# EasyEDA Pro project ProProject_雾化加湿器_2023-11-25.epro

# Schematic Schematic1
Create Date: 2023-11-10; Page Name: P1; Project Name: 雾化加湿器; Schematic Name: Schematic1; Update Date: 2023-12-05; Company: 嘉立创EDA; Page Size: A3; Version: V1.0
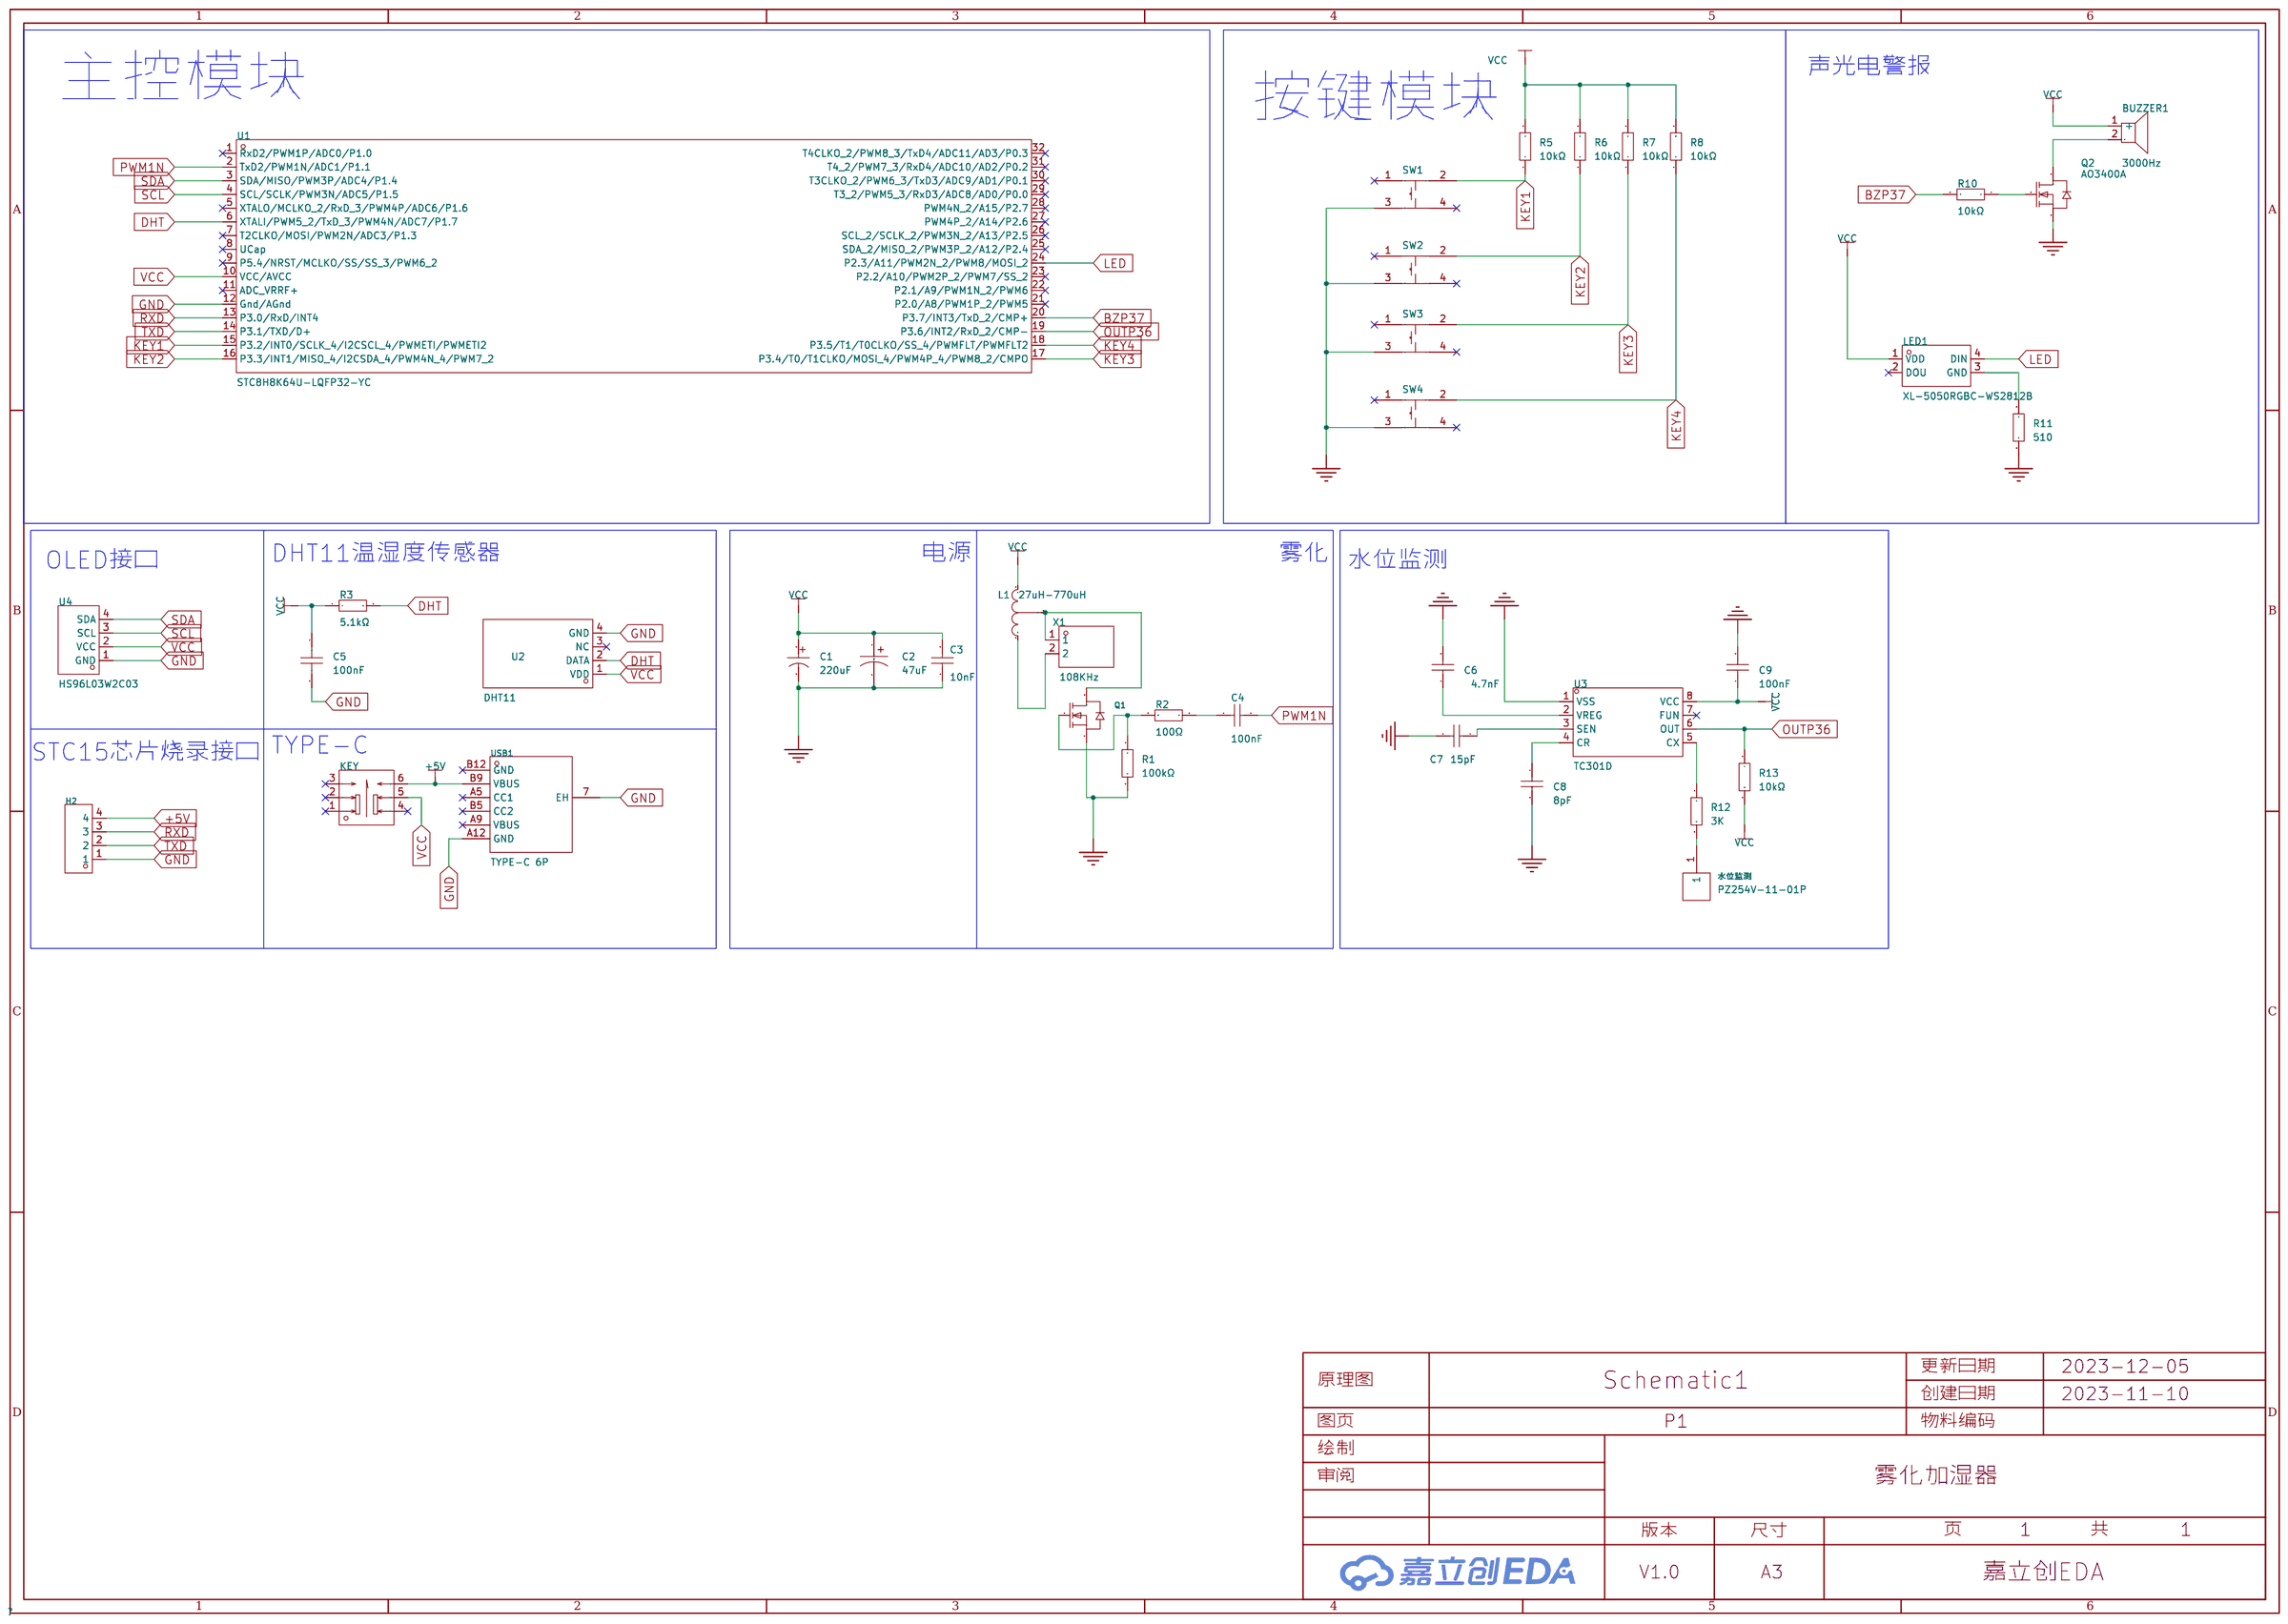
[diagram p0: schematic sheet]

## Parts
BUZZER1  3000Hz  [BUZ-TH_BD9.6-P5.00-D0.7-FD]
C1  220uF  [CAP-TH_BD10.0-P5.00-D1.0-FD]
C2  47uF  [CAP-TH_BD5.0-P2.00-D0.8-FD]
C3  10nF  [C0805]
C4  100nF  [C0805]
C5  100nF  [C0805]
C6  4.7nF  [C0805]
C7  15pF  [C0805]
C8  8pF  [C0805]
C9  100nF  [C0805]
H2  PZ254R-11-04P  [HDR-TH_4P-P2.54-V-M]
KEY  XKB5858-Z  [SW-TH_6P-L5.8-W5.8-P2.00-LS4.5-BL]
L1  27uH-770uH  [三脚电感]
LED1  XL-5050RGBC-WS2812B  [LED-SMD_4P-L5.0-W5.0-BL_XL-5050RGBC]
Q1  AO3400-HXY  [SOT-23_L2.9-W1.3-P1.90-LS2.4-BR]
Q2  AO3400A  [SOT-23_L2.9-W1.3-P1.90-LS2.4-BR]
R1  100kΩ  [R0805]
R2  100Ω  [R0805]
R3  5.1kΩ  [R0805]
R5  10kΩ  [R0805]
R6  10kΩ  [R0805]
R7  10kΩ  [R0805]
R8  10kΩ  [R0805]
R10  10kΩ  [R0805]
R11  510  [R0805]
R12  3K  [R0805]
R13  10kΩ  [R0805]
SW1  TS-1009S-03826  [SW-SMD_4P-L4.5-W4.5-P3.00-LS7.0]
SW2  TS-1009S-03826  [SW-SMD_4P-L4.5-W4.5-P3.00-LS7.0]
SW3  TS-1009S-03826  [SW-SMD_4P-L4.5-W4.5-P3.00-LS7.0]
SW4  TS-1009S-03826  [SW-SMD_4P-L4.5-W4.5-P3.00-LS7.0]
U1  STC8H8K64U-LQFP32-YC  [LQFP-32_L7.0-W7.0-P0.80-LS9.0-BL]
U2  DHT11  [SENSOR-TH_DHT11]
U3  TC301D  [SO-8_L4.9-W3.9-P1.27-LS5.9-BL]
U4  HS96L03W2C03  [OLED-TH_L27.8-W27.2-P2.54_C9900033791]
USB1  TYPE-C 6P  [TYPE-C-SMD_TYPE-C-6P]
X1  108KHz  [CONN-TH_B2B-XH-A-LF-SN]
水位监测  PZ254V-11-01P  [HDR-TH_1P-P2.54-V-M]

## Library data of the parts
BUZZER1 = HNB09A05: 驱动方式:有源(内含驱动线路);构造类型:电磁式;额定电压:5V;工作电压:4V~8V;频率:3000Hz;声压(SPL):85dB@5V,10cm;直径(φD):9mm;高度:5.7mm;; Supplier Part: C96493; Manufacturer: 华能; Supplier Footprint: 插件; JLCPCB Part Class: 扩展库; Datasheet: https://atta.szlcsc.com/upload/public/pdf/source/20170522/1495448327549.pdf; Supplier: LCSC; Oscillator Circuit: 有源(内含驱动线路); Technology Type: 电磁式; Rated Voltage: 5V; Operating Voltage: 4V~8V; Sound Pressure Level (SPL): 85dB@5V,10cm; Diameter (φD): 9mm; Height: 5.7mm
C1 = RNG221M1EBK-1012: 容值:220uF;精度:±20%;额定电压:25V;纹波电流:-;等效串联电阻:-;; LCSC Part Name: 220uF ±20% 25V 无极性电解电容; Supplier Part: C311677; Manufacturer: lelon(立隆); Supplier Footprint: 插件,D10xL12.5mm; JLCPCB Part Class: 扩展库; Datasheet: https://atta.szlcsc.com/upload/public/pdf/source/20180930/C311677_B35ED41A8A09BD51C9FDED5E2B65C0E1.pdf; Supplier: LCSC; Tolerance: ±20%; Rated Voltage: 25V; φD: 10mm; L: 12.5mm; Lead Spacing: 5mm; Lifetime @ Temp: 2000hrs@105℃
C2 = 01EC1882SHG47uF16V: 容值:47uF;精度:±20%;额定电压:16V;纹波电流:95mA@100kHz;等效串联电阻:2.5Ω@100kHz;; LCSC Part Name: 47uF ±20% 16V 高频低阻抗电解电容器; Supplier Part: C503214; Manufacturer: KNSCHA(科尼盛); Supplier Footprint: 插件,D5xL11mm; JLCPCB Part Class: 扩展库; Datasheet: https://atta.szlcsc.com/upload/public/pdf/source/20200324/C503214_31C96C8D88F229C9201DC621C0C9C05E.pdf; Supplier: LCSC; Tolerance: ±20%; Rated Voltage: 16V; φD: 5mm; L: 11mm; Lead Spacing: 2mm; Ripple Current: 95mA@100kHz; Equivalent Series Resistance(ESR): 2.5Ω@100kHz; Lifetime @ Temp: 10000hrs@105℃
C3 C4 C6-C9 = 0805B103K500NT_C52278: 容值:10nF;精度:±10%;额定电压:50V;材质(温度系数):X7R;; LCSC Part Name: 10nF ±10% 50V; Supplier Part: C52278; Manufacturer: FH(风华); Manufacturer Part: 0805B103K500NT; Supplier Footprint: 0805; JLCPCB Part Class: 扩展库; Datasheet: https://atta.szlcsc.com/upload/public/pdf/source/20170923/C52278_1506149485247988826.pdf; Supplier: LCSC; Tolerance: ±10%; Voltage Rated: 50V; Temperature Coefficient: X7R
C5 = CT41G-0805-2X1-50V-0.1μF-K(N): 容值:100nF;精度:±10%;额定电压:50V;材质(温度系数):2X1;; LCSC Part Name: 100nF ±10% 50V; Supplier Part: C126469; Manufacturer: TORCH(火炬); Supplier Footprint: 0805; JLCPCB Part Class: 扩展库; Datasheet: https://atta.szlcsc.com/upload/public/pdf/source/20171225/C150708_15141883600121203188.pdf; Supplier: LCSC; Tolerance: ±10%; Voltage Rated: 50V; Temperature Coefficient: 2X1
H2 = PZ254R-11-04P: 间距:2.54mm;总PIN位数:4;排数:1;插针结构:1x4P;行距:-;安装类型:弯插;圆针/方针:方针;额定电流:-;额定电压:-;配合针长度:6mm;塑高:2.5mm;触头材质:黄铜;触头镀层:-;工作温度范围:-40℃~+105℃;颜色:黑色;; LCSC Part Name: 2.54mm 1x4P 弯插 方针; Supplier Part: C492412; Manufacturer: XFCN(兴飞); Supplier Footprint: 插件,P=2.54mm; JLCPCB Part Class: 扩展库; Supplier: LCSC; Pitch: 2.54mm; Number of Pins: 4; Number of Rows: 1; Pin Structure: 1x4P; Mounting Type: 弯插; Circluar Pins/Square Pins: 方针; Length of Mating Pin: 6mm; Insulation Height: 2.5mm; Contact Material: 黄铜; Operating Temperature Range: -40℃~+105℃; Color: 黑色
KEY = XKB5858-Z: 触点电流:100mA;额定电压 (AC):250V;额定电压 (DC):30V;绝缘电阻:100MΩ;电路结构:-;安装方式:直插;自锁/无锁:自锁;按键形状:矩形按钮;按键/盖帽颜色:白色;带灯:无;引脚样式:PC引脚;作用力:160gf@±80gf;防护等级:-;工作温度:-15℃~+55℃;机械寿命:10000;; LCSC Part Name: 按键开关   5.8*5.8插件自锁开关; Supplier Part: C318868; Manufacturer: XKB Connectivity(中国星坤); Supplier Footprint: 插件; JLCPCB Part Class: 扩展库; Datasheet: https://atta.szlcsc.com/upload/public/pdf/source/20181029/C318868_9BE55E0EBE6A2C886ABBB20B390835AF.pdf; Supplier: LCSC; Contact Current: 100mA; Voltage Rating (AC): 250V; Voltage Rating (DC): 30V; Insulation Resistance: 100MΩ; Mounting Style: 直插; Self Lock / No Lock: 自锁; Actuator Style: 矩形按钮; Actuator/Cap Color: 白色; With Lamp: 无; Pin Style: PC引脚; Operating Force: 160gf@±80gf; Operating Temperature: -15℃~+55℃; Mechanical Life: 10000
L1 = PDPTAT0810-2R2M: 电感值:2.2uH;精度:±20%;额定电流:7A;饱和电流(Isat):11A;; LCSC Part Name: 2.2uH ±20% 11A; Supplier Part: C5119615; Manufacturer: PROD(谱罗德); Supplier Footprint: 插件,D9.5xL12mm; JLCPCB Part Class: 扩展库; Datasheet: https://atta.szlcsc.com/upload/public/pdf/source/20220822/5B60B05AFB4608D4108D4169B534A2A0.pdf; Supplier: LCSC; Tolerance: ±20%; Rated Current: 7A; Current - Saturation (Isat): 11A; DC Resistance: 11mΩ
LED1 = XL-5050RGBC-WS2812B: 发光颜色:RGB三色;二极管配置:-;主波长:-;色温:-;功率:-;安装方式:正贴;; LCSC Part Name: RGB三色 正贴 幻彩; Supplier Part: C2843785; Manufacturer: XINGLIGHT(成兴光); Supplier Footprint: SMD5050; JLCPCB Part Class: 扩展库; Datasheet: https://atta.szlcsc.com/upload/public/pdf/source/20230111/86AAD2096485A2E5BCAB883FF8CBE6FD.pdf; Supplier: LCSC; Emitted Color: RGB三色; Lens Color: 无色透明; Peak Wavelength: 625nm；470nm；530nm; Viewing Angle: 120°; Mounting Sytle: 正贴; Operating Temperature: -30℃~+70℃
Q1 = AO3400-HXY: 类型:N沟道;漏源电压(Vdss):30V;连续漏极电流(Id):5.8A;功率(Pd):1.4W;导通电阻(RDS(on)@Vgs,Id):28mΩ@10V,5.8A;; LCSC Part Name: N沟道 30V 5.8A; Supplier Part: C4748804; Manufacturer: HXY MOSFET(华轩阳电子); Supplier Footprint: SOT-23; JLCPCB Part Class: 扩展库; Datasheet: https://atta.szlcsc.com/upload/public/pdf/source/20221216/C6CAAE960F4F5F0616BD2E5413E1C3AD.pdf; Supplier: LCSC; Type: N沟道; Drain Source Voltage (Vdss): 30V; Continuous Drain Current (Id): 5.8A; Power Dissipation (Pd): 1.4W; Drain Source On Resistance (RDS(on)@Vgs,Id): 28mΩ@10V,5.8A; Gate Threshold Voltage (Vgs(th)@Id): 1.4V@250uA; Input Capacitance (Ciss@Vds): 825pF@15V
Q2 = AO3400A_C344010: 类型:N沟道;漏源电压(Vdss):30V;连续漏极电流(Id):5.8A;功率(Pd):1.4W;导通电阻(RDS(on)@Vgs,Id):32mΩ@10V,5.8A;阈值电压(Vgs(th)@Id):1.4V@250uA;; LCSC Part Name: N沟道 30V 5.8A; Supplier Part: C344010; Manufacturer: BORN(伯恩半导体); Supplier Footprint: SOT-23; JLCPCB Part Class: 扩展库; Datasheet: https://atta.szlcsc.com/upload/public/pdf/source/20181211/C344010_1A88330921524F88534EF594457919E8.pdf; Supplier: LCSC; Type: N沟道; Drain Source Voltage (Vdss): 30V; Continuous Drain Current (Id): 5.8A; Power Dissipation (Pd): 1.4W; Drain Source On Resistance (RDS(on)@Vgs,Id): 32mΩ@10V,5.8A; Gate Threshold Voltage (Vgs(th)@Id): 1.4V@250uA
R1 R2 R5-R8 R10-R13 = 0805W8F1002T5E_C17414: 电阻类型:厚膜电阻;阻值:10kΩ;精度:±1%;功率:125mW;; LCSC Part Name: 10kΩ ±1% 125mW; Supplier Part: C17414; Manufacturer: UNI-ROYAL(厚声); Manufacturer Part: 0805W8F1002T5E; Supplier Footprint: 0805; JLCPCB Part Class: 基础库; Datasheet: https://atta.szlcsc.com/upload/public/pdf/source/20200306/C422600_1E6D84923E4A46A82E41ADD87F860B5C.pdf; Supplier: LCSC; Type: 厚膜电阻; Tolerance: ±1%; Power(Watts): 125mW; Temperature Coefficient: ±100ppm/℃; Overload Voltage (Max): 150V; Operating Temperature Range: -55℃~+155℃
R3 = 0805W8F5101T5E: 电阻类型:厚膜电阻;阻值:5.1kΩ;精度:±1%;功率:125mW;; LCSC Part Name: 5.1kΩ ±1% 125mW; Supplier Part: C27834; Manufacturer: UNI-ROYAL(厚声); Supplier Footprint: 0805; JLCPCB Part Class: 基础库; Datasheet: https://atta.szlcsc.com/upload/public/pdf/source/20200306/C422600_1E6D84923E4A46A82E41ADD87F860B5C.pdf; Supplier: LCSC; Type: 厚膜电阻; Tolerance: ±1%; Power(Watts): 125mW; Temperature Coefficient: ±100ppm/℃; Overload Voltage (Max): 150V; Operating Temperature Range: -55℃~+155℃
SW1-SW4 = TS-1009S-03826: 触点电流:50mA;额定电压(DC):12V;电路结构:单刀单掷;安装方式:立贴;带灯:-;机械寿命:-;; LCSC Part Name: 4.5*4.5*3.8mm 立贴 轻触开关; Supplier Part: C455243; Manufacturer: XUNPU(讯普); Supplier Footprint: SMD,4.5x4.5mm; JLCPCB Part Class: 扩展库; Datasheet: https://atta.szlcsc.com/upload/public/pdf/source/20191118/C455243_A418D3F018154E2D7AB449710B6F1A73.pdf; Supplier: LCSC; Contact Current: 50mA; Voltage Rating (DC): 12V; Circuit: 单刀单掷; Mounting Style: 立贴; Actuator Style: 圆形按钮; Switch Length: 4.5mm; Switch Width: 4.5mm; Switch Height: 3.8mm
U1 = STC8H8K64U-LQFP32-YC: Supplier Part: C9900031452; Supplier Footprint: LQFP-32_L7.0-W7.0-P0.80-LS9.0-; JLCPCB Part Class: 扩展库; Supplier: LCSC
U2 = DHT11: 新款电容式数字温湿度传感器,老款已停产16.1x12.6x5.8mm; LCSC Part Name: DHT11  电容式传感器; Supplier Part: C117051; Manufacturer: 广州奥松; Supplier Footprint: SIP-4; JLCPCB Part Class: 扩展库; Datasheet: https://atta.szlcsc.com/upload/public/pdf/source/20170703/1499081238365.pdf; Supplier: LCSC
U3 = TC301D: LCSC Part Name: 单通道水位检测/人体感应; Supplier Part: C362144; Manufacturer: NUTECH(诺泰); Supplier Footprint: SO-8; JLCPCB Part Class: 扩展库; Datasheet: https://atta.szlcsc.com/upload/public/pdf/source/20191125/C362144_027B89DBA359C9125D5EE7B15DEF22AA.pdf; Supplier: LCSC
U4 = HS96L03W2C03: 尺寸(inch)：0.96寸 0.96&apos; 像素分辨率：128x64 128*64主控芯片：SSD1315 接口类型：I2C 外形:27.3*27.8；IIC/3SPI/4SPI串口通讯,工作温度范围-40℃—+70℃。4PIN黑底白光。; LCSC Part Name: 0.96寸OLED显示屏窄白光IIC; Supplier Part: C5248080; Manufacturer: HS(汉昇); JLCPCB Part Class: 扩展库; Datasheet: https://atta.szlcsc.com/upload/public/pdf/source/20230627/763D01F79A90007632F098068C7C8AD9.pdf; Supplier: LCSC
USB1 = TYPE-C 6P: 连接器类型:Type-C;标准:-;公母:母座;触点数量:6;端口数量:1;安装方式:卧贴;额定电流 - 电源:-;工作温度范围:-40℃~+85℃;; LCSC Part Name: Type-C 母头 6pin简易款四脚端子SMT+DIP 停产; Supplier Part: C456012; Manufacturer: SHOU HAN(首韩); Supplier Footprint: SMD; JLCPCB Part Class: 扩展库; Supplier: LCSC; Connector Type: Type-C; Gender: 母座; Number of Contacts: 6; Number of Ports: 1; Mounting Style: 卧贴; Operating Temperature Range: -40℃~+85℃
X1 = B2B-XH-A(LF)(SN): 参考系列:XH;间距:2.5mm;插针结构:1x2P;排数:1;每排PIN数:2;行距:-;安装方式:-;触头材质:黄铜;; LCSC Part Name: 系列:XH 间距:2.5mm 1x2P; Supplier Part: C158012; Manufacturer: JST; Supplier Footprint: 插件,P=2.5mm; JLCPCB Part Class: 扩展库; Datasheet: https://atta.szlcsc.com/upload/public/pdf/source/20180928/C265283_F9DFEEBDB2CF642B6BDFAB4B77BD2680.pdf; Supplier: LCSC; Reference Series: XH; Pitch: 2.5mm; Pins Structure: 1x2P; Number of Rows: 1; Number of PINs Per Row: 2; Contact Material: 黄铜
水位监测 = PZ254V-11-01P: 排数:单排;总PIN位数:1P;间距:2.54mm;插针结构:1x1P;行距:-;安装类型:直插;圆针/方针:方针;额定电流:-;额定电压:-;配合针长度:6mm;塑高:2.5mm;端接针长度:3mm;触头材质:黄铜;触头镀层:-;工作温度范围:-40℃~+105℃;颜色:黑色;; LCSC Part Name: 2.54mm 1x1P 直插 方针; Supplier Part: C492400; Manufacturer: XFCN(兴飞); Supplier Footprint: 插件,P=2.54mm; JLCPCB Part Class: Extended Part; Datasheet: https://atta.szlcsc.com/upload/public/pdf/source/20200309/C492400_46876A5B545F5AE6B8D4A09C46E276E8.pdf; Supplier: LCSC; Number of Rows: 单排; Number of Pins: 1P; Pitch: 2.54mm; Pin Structure: 1x1P; Mounting Type: 直插; Circluar Pins/Square Pins: 方针; Length of Mating Pin: 6mm; Insulation Height: 2.5mm; Length of End Connection Pin: 3mm; Contact Material: 黄铜; Operating Temperature Range: -40℃~+105℃; Color: 黑色

## Nets
+5V: H2.4 KEY.6 USB1.B9(VBUS)
GND: C1.2 C2.2 C3.1 C5.2 C6.2 C7.2 C8.2 C9.2 H2.1 Q1.2(S) Q2.2(S) R1.2 R11.1 SW1.3 SW2.3 SW3.3 SW4.3 U1.12(Gnd/AGnd) U2.4(GND) U3.1(VSS) U4.1(GND) USB1.7(EH) USB1.A12(GND)
VCC: BUZZER1.1(+) C1.1 C2.1 C3.2 C5.1 C9.1 KEY.5 L1.1 LED1.1(VDD) R3.1 R5.2 R6.2 R7.2 R8.2 R13.2 U1.10(VCC/AVCC) U2.1(VDD) U3.8(VCC) U4.2(VCC)
BZP37: R10.2 U1.20(P3.7/INT3/TxD_2/CMP+)
DHT: R3.2 U1.6(XTALI/PWM5_2/TxD_3/PWM4N/ADC7/P1.7) U2.2(DATA)
KEY1: R5.1 SW1.2 U1.15(P3.2/INT0/SCLK_4/I2CSCL_4/PWMETI/PWMETI2)
KEY2: R6.1 SW2.2 U1.16(P3.3/INT1/MISO_4/I2CSDA_4/PWM4N_4/PWM7_2)
KEY3: R7.1 SW3.2 U1.17(P3.4/T0/T1CLKO/MOSI_4/PWM4P_4/PWM8_2/CMPO)
KEY4: R8.1 SW4.2 U1.18(P3.5/T1/T0CLKO/SS_4/PWMFLT/PWMFLT2)
LED: LED1.4(DIN) U1.24(P2.3/A11/PWM2N_2/PWM8/MOSI_2)
OUTP36: R13.1 U1.19(P3.6/INT2/RxD_2/CMP-) U3.6(OUT)
PWM1N: C4.2 U1.2(TxD2/PWM1N/ADC1/P1.1)
RXD: H2.3 U1.13(P3.0/RxD/INT4)
SCL: U1.4(SCL/SCLK/PWM3N/ADC5/P1.5) U4.3(SCL)
SDA: U1.3(SDA/MISO/PWM3P/ADC4/P1.4) U4.4(SDA)
TXD: H2.2 U1.14(P3.1/TXD/D+)
$1N10142: L1.2 X1.2
$1N10159: L1.3 Q1.3(D) X1.1
$1N10823: C4.1 R2.1
$1N13950: C6.1 U3.2(VREG)
$1N13954: C7.1 U3.3(SEN)
$1N13974: C8.1 U3.4(CR)
$1N14222: R12.1 U3.5(CX)
$1N14357: R12.2 水位监测.1
$1N14582: Q2.1(G) R10.1
$1N14588: BUZZER1.2 Q2.3(D)
$1N14898: LED1.3(GND) R11.2
$1N21387: Q1.1(G) R1.1 R2.2

Not connected (* = marked no-connect by the designer): KEY 1* 2* 3* 4*; LED1 2(DOU)*; SW1 1* 4*; SW2 1* 4*; SW3 1* 4*; SW4 1* 4*; U1 1(RxD2/PWM1P/ADC0/P1.0)* 5(XTALO/MCLKO_2/RxD_3/PWM4P/ADC6/P1.6)* 7(T2CLKO/MOSI/PWM2N/ADC3/P1.3)* 8(UCap)* 9(P5.4/NRST/MCLKO/SS/SS_3/PWM6_2)* 11(ADC_VRRF+)* 21(P2.0/A8/PWM1P_2/PWM5)* 22(P2.1/A9/PWM1N_2/PWM6)* 23(P2.2/A10/PWM2P_2/PWM7/SS_2)* 25(SDA_2/MISO_2/PWM3P_2/A12/P2.4)* 26(SCL_2/SCLK_2/PWM3N_2/A13/P2.5)* 27(PWM4P_2/A14/P2.6)* 28(PWM4N_2/A15/P2.7)* 29(T3_2/PWM5_3/RxD3/ADC8/AD0/P0.0)* 30(T3CLKO_2/PWM6_3/TxD3/ADC9/AD1/P0.1)* 31(T4_2/PWM7_3/RxD4/ADC10/AD2/P0.2)* 32(T4CLKO_2/PWM8_3/TxD4/ADC11/AD3/P0.3)*; U2 3(NC)*; U3 7(FUN)*; USB1 A5(CC1)* A9(VBUS)* B5(CC2)* B12(GND)*

## Notes on the sheet
- 声光电警报
- 主控模块
- 按键模块
- DHT11温湿度传感器
- 电源
- 雾化
- OLED接口
- 水位监测
- TYPE-C
- STC15芯片烧录接口

# Board PCB1
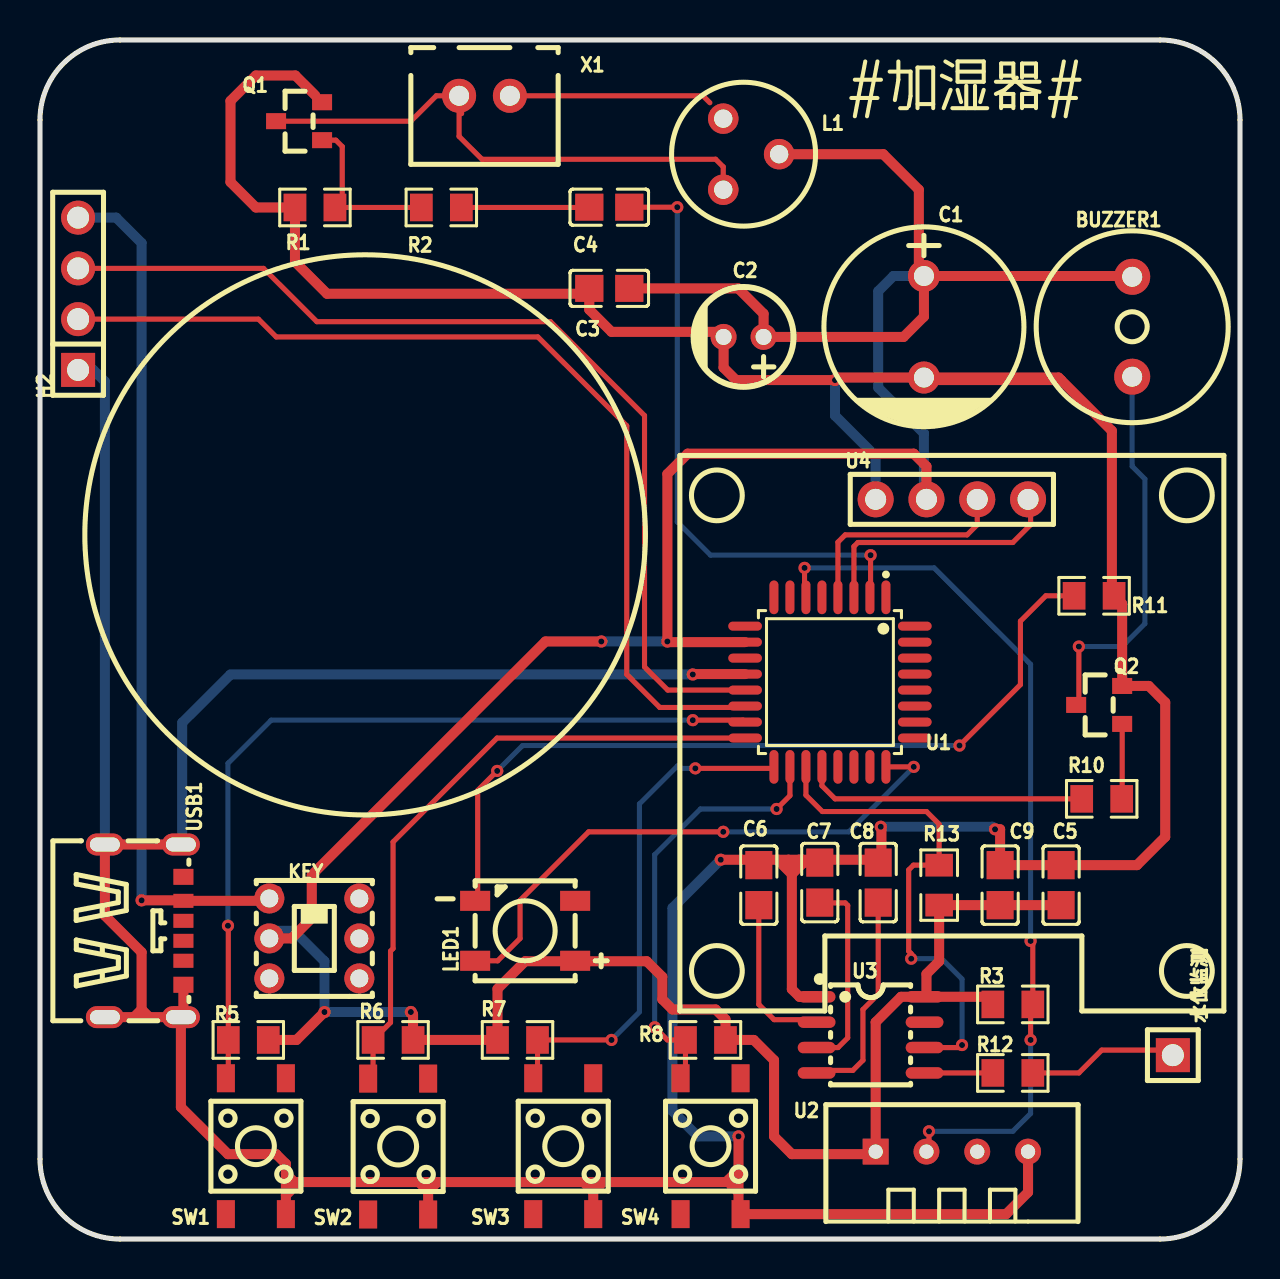
[diagram p1: board, top side]
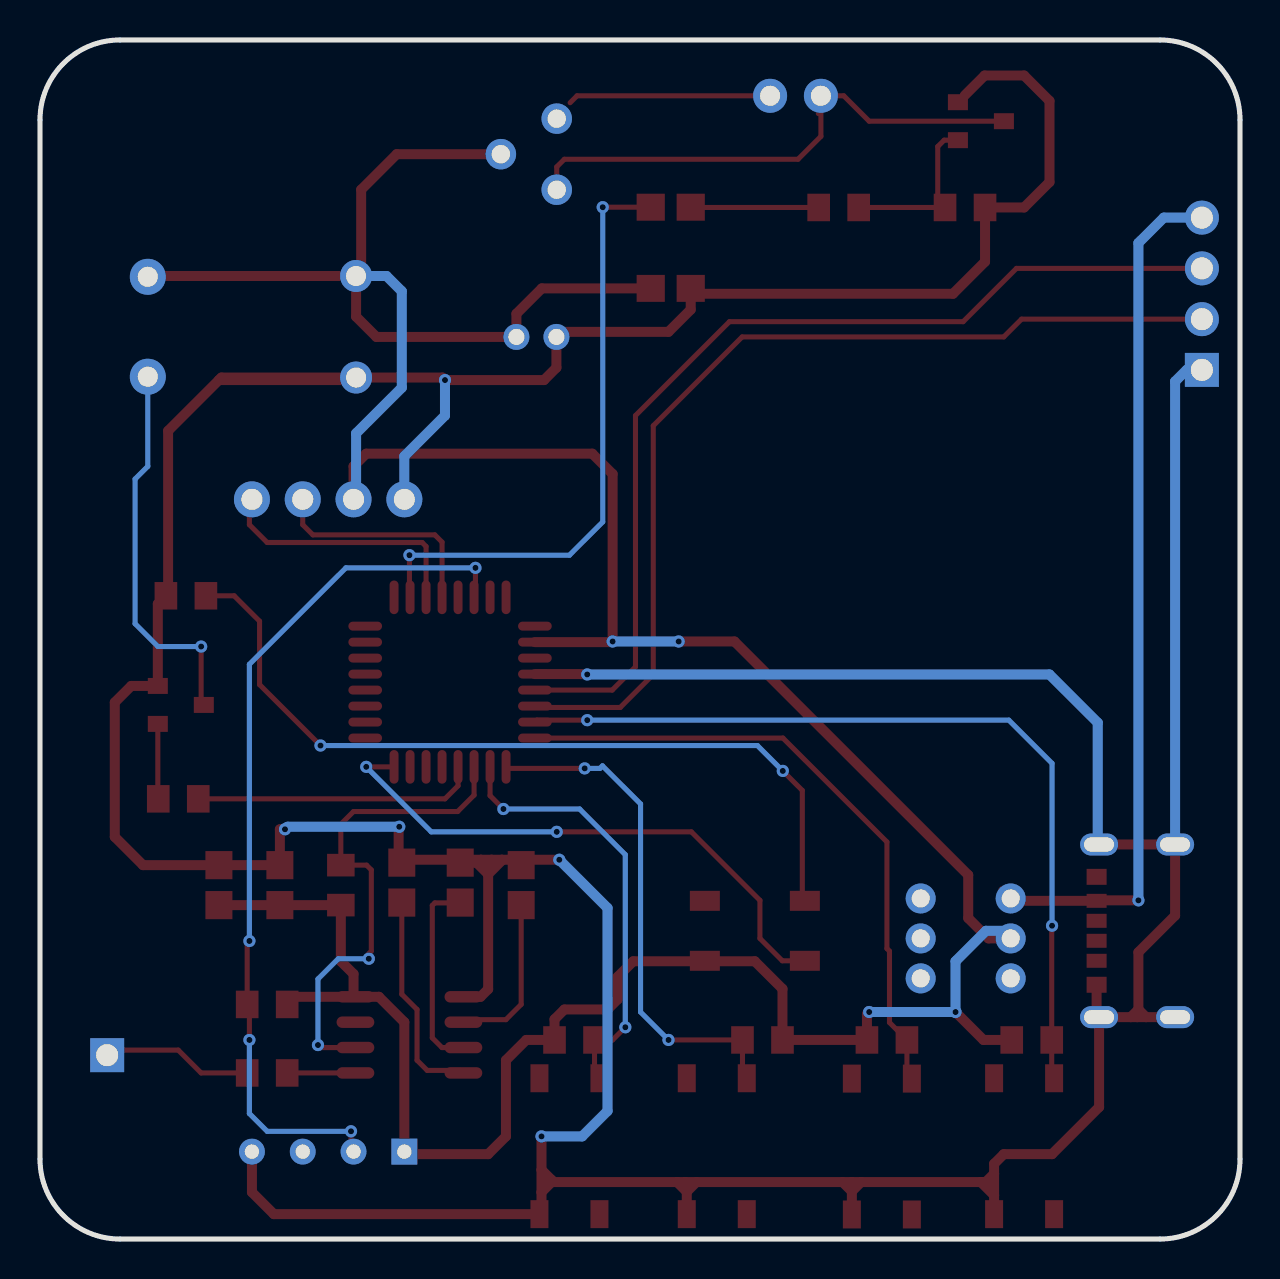
[diagram p2: board, bottom side, seen from below]

Outline 60 x 60 mm; copper layers: Top Layer, Bottom Layer. Coordinates in mm from the lower left corner of the outline.
Outline path: 0,56 0,4 arc(1.17,1.17) 4,0 56,0 arc(58.83,1.17) 60,4 60,56 arc(58.83,58.83) 56,60 4,60 arc(1.17,58.83) 0,56
Stack: Top Layer 0.035mm / Dielectric1 1.51mm FR4 er 4.5 / Bottom Layer 0.035mm

## Design rules (mm)
template: 自定义配置
spacing copperThickness1oz (default): track to track 0.102, other pairs 0.152 to 0.3
spacing copperThickness2oz: track to track 0.203, other pairs 0.152 to 0.3
track width copperThickness1oz (default): min 0.127, default 0.254, max 2.54
track width copperThickness2oz: min 0.203, default 0.254, max 2.54
track width GNDANAPOWER: min 0.4, default 0.5, max 0.6
differential pair differentialPair (default): width min 0.127, default 0.254, max 2.54; gap min 0.152, default 0.152
via viaSize (default): diameter min 0.5, default 0.61, max 10; hole min 0.3, default 0.305, max 6.3
net VCC uses GNDANAPOWER
net GND uses GNDANAPOWER
net +5V uses GNDANAPOWER

## Placement (name value [footprint] x y rotation side)
BUZZER1  3000Hz  [BUZ-TH_BD9.6-P5.00-D0.7-FD]  54.61 45.65 270 top
C1  220uF  [CAP-TH_BD10.0-P5.00-D1.0-FD]  44.2 45.65 270 top
C2  47uF  [CAP-TH_BD5.0-P2.00-D0.8-FD]  35.18 45.14 180 top
C3  10nF  [C0805]  28.46 47.57 0 top
C4  100nF  [C0805]  28.46 51.63 0 top
C5  100nF  [C0805]  51.05 17.71 90 top
C6  4.7nF  [C0805]  35.94 17.71 90 top
C7  15pF  [C0805]  38.99 17.84 90 top
C8  8pF  [C0805]  41.91 17.84 90 top
C9  100nF  [C0805]  48.01 17.71 90 top
H2  PZ254R-11-04P  [HDR-TH_4P-P2.54-V-M]  1.91 47.3 90 top
KEY  XKB5858-Z  [SW-TH_6P-L5.8-W5.8-P2.00-LS4.5-BL]  13.72 15.04 90 top
L1  27uH-770uH  [三脚电感]  35.18 54.28 270 top
LED1  XL-5050RGBC-WS2812B  [LED-SMD_4P-L5.0-W5.0-BL_XL-5050RGBC]  24.26 15.42 90 top
Q1  AO3400-HXY  [SOT-23_L2.9-W1.3-P1.90-LS2.4-BR]  12.95 55.94 0 top
Q2  AO3400A  [SOT-23_L2.9-W1.3-P1.90-LS2.4-BR]  52.96 26.73 0 top
R1  100kΩ  [R0805]  13.75 51.62 180 top
R2  100Ω  [R0805]  20.07 51.62 180 top
R3  5.1kΩ  [R0805]  48.64 11.74 0 top
R5  10kΩ  [R0805]  10.41 9.96 0 top
R6  10kΩ  [R0805]  17.65 9.96 0 top
R7  10kΩ  [R0805]  23.88 9.96 180 top
R8  10kΩ  [R0805]  33.27 9.96 0 top
R10  10kΩ  [R0805]  53.09 22.03 180 top
R11  510  [R0805]  52.71 32.19 180 top
R12  3K  [R0805]  48.64 8.31 0 top
R13  10kΩ  [R0805]  44.96 17.71 270 top
SW1  TS-1009S-03826  [SW-SMD_4P-L4.5-W4.5-P3.00-LS7.0]  10.8 4.65 90 top
SW2  TS-1009S-03826  [SW-SMD_4P-L4.5-W4.5-P3.00-LS7.0]  17.91 4.63 90 top
SW3  TS-1009S-03826  [SW-SMD_4P-L4.5-W4.5-P3.00-LS7.0]  26.16 4.65 90 top
SW4  TS-1009S-03826  [SW-SMD_4P-L4.5-W4.5-P3.00-LS7.0]  33.53 4.65 90 top
U1  STC8H8K64U-LQFP32-YC  [LQFP-32_L7.0-W7.0-P0.80-LS9.0-BL]  39.5 27.87 180 top
U2  DHT11  [SENSOR-TH_DHT11]  45.59 4.37 0 top
U3  TC301D  [SO-8_L4.9-W3.9-P1.27-LS5.9-BL]  41.53 10.22 270 top
U4  HS96L03W2C03  [OLED-TH_L27.8-W27.2-P2.54_C9900033791]  45.59 37.01 0 top
USB1  TYPE-C 6P  [TYPE-C-SMD_TYPE-C-6P]  5.21 15.42 270 top
X1  108KHz  [CONN-TH_B2B-XH-A-LF-SN]  22.22 57.21 180 top
水位监测  PZ254V-11-01P  [HDR-TH_1P-P2.54-V-M]  56.64 9.2 0 top

## Footprints (pads in the part's own frame, mm; a bottom-side part is the same pattern mirrored in y, then rotated)
BUZ-TH_BD9.6-P5.00-D0.7-FD
  round 1.8 hole 1: 1(-2.5,0) 2(2.5,0)
C0805
  rect 1.41x1.35 smd: 1(-1,0) 2(1,0)
CAP-TH_BD5.0-P2.00-D0.8-FD
  round 1.3 hole 0.8: 1(-1,0) 2(1,0)
CAP-TH_BD10.0-P5.00-D1.0-FD
  round 1.6 hole 1: 1(-2.54,0) 2(2.54,0)
CONN-TH_B2B-XH-A-LF-SN
  round 1.7 hole 1: 1(1.27,0) 2(-1.27,0)
HDR-TH_1P-P2.54-V-M
  rect 1.7x1.7 hole 1.1: 1(0,0)
HDR-TH_4P-P2.54-V-M
  rect 1.7x1.7 hole 1.1: 1(-3.81,0)
  round 1.7 hole 1.1: 2(-1.27,0) 3(1.27,0) 4(3.81,0)
LED-SMD_4P-L5.0-W5.0-BL_XL-5050RGBC
  rect 1x1.5 smd: 1(-1.5,-2.5) 2(1.5,-2.5) 3(1.5,2.5) 4(-1.5,2.5)
LQFP-32_L7.0-W7.0-P0.80-LS9.0-BL
  oval 0.448x1.684 smd: 1(-2.8,-4.242) 2(-2,-4.242) 3(-1.2,-4.242) 4(-0.4,-4.242) 5(0.4,-4.242) 6(1.2,-4.242) 7(2,-4.242) 8(2.8,-4.242) 17(2.8,4.242) 18(2,4.242) 19(1.2,4.242) 20(0.4,4.242) 21(-0.4,4.242) 22(-1.2,4.242) 23(-2,4.242) 24(-2.8,4.242)
  oval 1.684x0.448 smd: 9(4.242,-2.8) 10(4.242,-2) 11(4.242,-1.2) 12(4.242,-0.4) 13(4.242,0.4) 14(4.242,1.2) 15(4.242,2) 16(4.242,2.8) 25(-4.242,2.8) 26(-4.242,2) 27(-4.242,1.2) 28(-4.242,0.4) 29(-4.242,-0.4) 30(-4.242,-1.2) 31(-4.242,-2) 32(-4.242,-2.8)
OLED-TH_L27.8-W27.2-P2.54_C9900033791
  round 1.8 hole 1.05: 1(-3.81,0) 2(-1.27,0) 3(1.27,0) 4(3.81,0)
R0805
  rect 1.133x1.377 smd: 1(-1,0) 2(1,0)
SENSOR-TH_DHT11
  rect 1.296x1.296 hole 0.711: 1(-3.81,0)
  round 1.296 hole 0.711: 2(-1.27,0) 3(1.27,0) 4(3.81,0)
SO-8_L4.9-W3.9-P1.27-LS5.9-BL
  oval 0.574x1.888 smd: 1(-1.905,-2.699) 2(-0.635,-2.699) 3(0.635,-2.699) 4(1.905,-2.699) 5(1.905,2.699) 6(0.635,2.699) 7(-0.635,2.699) 8(-1.905,2.699)
SOT-23_L2.9-W1.3-P1.90-LS2.4-BR
  rect 1x0.8 smd: 1(1.15,-0.95) 2(1.15,0.95) 3(-1.15,0)
SW-SMD_4P-L4.5-W4.5-P3.00-LS7.0
  rect 1.4x0.9 smd: 1(-3.4,1.5) 2(3.4,1.5) 3(-3.4,-1.5) 4(3.4,-1.5)
SW-TH_6P-L5.8-W5.8-P2.00-LS4.5-BL
  round 1.5 hole 0.9: 1(-2,-2.25) 2(0,-2.25) 3(2,-2.25) 4(-2,2.25) 5(0,2.25) 6(2,2.25)
TYPE-C-SMD_TYPE-C-6P
  oval 1.1x1.9 hole 0.7x1.5: 7(-4.32,1.837) 7(-4.32,-1.962) 7(4.32,1.837) 7(4.32,-1.962)
  rect 0.7x1 smd: A5(-0.5,1.962) A9(1.5,1.962) B5(0.5,1.962) B9(-1.5,1.962)
  rect 0.8x1 smd: A12(2.7,1.962) B12(-2.7,1.962)
三脚电感
  round 1.524 hole 0.914: 1(0,1.778) 2(-1.778,-1.016) 3(1.778,-1.016)

## Nets
As in the schematic.

Pads without a net: KEY 1 2 3 4; LED1 2; SW1 1 4; SW2 1 4; SW3 1 4; SW4 1 4; U1 1 5 7 8 9 11 21 22 23 25 26 27 28 29 30 31 32; U2 3; U3 7; USB1 A5 A9 B5 B12

## Via types
v1: diameter 0.61, hole 0.305, Top Layer to Bottom Layer, 30 vias

## Routing (per net, layer and track width the routed paths; a pad name or vN(x,y) marks a point on that pad's centre or on a via; arc(x,y) is an arc through that point)
+5V: length 43.6
  Top Layer w0.5: 11.85,17.42 11.35,16.92 USB1.B9 7.15,16.95 v1(5.08,16.95)
  Bottom Layer w0.5: v1(5.08,16.95) 5.08,49.84 3.81,51.11 H2.4
GND: length 298.7
  Top Layer w0.5: 37.95,18.98 41.89,18.98 42.07,18.8 ; 37.95,18.98 37.42,18.98 ; 37.95,18.98 37.81,18.84 ; 34.42,2.85 34.93,2.34 ; 34.42,2.85 34.42,2.95 34.93,3.46 ; 34.42,2.85 28.15,2.85 ; 34.93,2.34 34.93,1.35 SW4.3 48.31,1.25 49.4,2.34 U2.4 ; 34.93,2.34 34.93,3.46 ; 42.07,18.8 42.07,20.6 v1(42.04,20.63) ; 42.07,18.8 41.81,18.8 41.78,18.84 ; C1.2 50.93,43.11 51.05,42.98 ; C1.2 44.32,42.98 51.05,42.98 ; C1.2 39.88,43.11 v1(39.75,42.98) 34.8,42.98 34.18,43.6 C2.2 33.93,45.39 28.58,45.39 27.46,46.51 C3.1 27.19,47.3 14.35,47.3 12.75,48.9 R1.2 10.8,51.62 9.53,52.89 9.53,56.95 10.8,58.22 12.77,58.22 13.77,57.22 ; U1.12 32.66,28.27 v1(32.64,28.25) ; 5.14,11.1 5.08,11.16 5.08,11.49 ; 5.14,11.1 5.46,11.1 ; 5.14,11.1 4.7,11.1 ; SW1.3 12.3,2.19 ; 12.3,2.19 12.95,2.85 ; 12.3,2.19 12.3,3.27 ; 19.41,2.39 19.87,2.85 ; 19.41,2.39 19.41,1.25 ; 19.41,2.39 18.94,2.85 ; 19.41,2.39 19.41,2.85 ; 19.87,2.85 19.41,2.85 ; 19.87,2.85 27.18,2.85 ; 27.66,2.37 27.66,2.77 27.74,2.85 ; 27.66,2.37 SW3.3 ; 27.66,2.37 27.18,2.85 ; 27.66,2.37 28.15,2.85 ; 12.95,2.85 12.71,2.85 12.3,3.27 ; 12.95,2.85 18.94,2.85 ; 28.15,2.85 27.74,2.85 ; 27.74,2.85 27.18,2.85 ; 37.59,18.26 37.59,18.62 ; 37.59,18.26 38.14,18.81 38.14,18.84 ; 37.59,18.26 37.59,12.5 37.97,12.12 U3.1 ; 37.59,18.26 36.9,18.95 36.9,18.98 ; 37.59,18.62 37.59,18.81 37.57,18.84 ; 37.59,18.62 37.81,18.84 ; 38.14,18.84 37.81,18.84 ; 38.14,18.84 C7.2 ; 19.41,2.85 18.94,2.85 ; 12.3,3.27 12.3,3.76 11.81,4.25 9.4,4.25 7.04,6.6 7.04,11.1 ; 5.46,11.1 5.08,11.49 ; 5.46,11.1 7.04,11.1 ; 37.42,18.98 36.9,18.98 ; 37.42,18.98 37.57,18.84 ; 5.08,11.49 4.7,11.1 ; 5.08,11.49 5.08,14.35 3.24,16.18 USB1.7 USB1.7 ; 51.05,42.98 53.59,40.44 53.59,32.3 R11.1 54.11,31.78 Q2.2 55.44,27.68 56.26,26.85 56.26,20.12 54.85,18.71 C5.2 C9.2 48.01,20.5 v1(47.75,20.5) ; 34.93,3.46 v1(34.93,5.14) ; 37.81,18.84 37.57,18.84 ; 36.9,18.98 v1(34.04,18.98) ; 7.04,11.1 7.17,11.23 USB1.A12 ; 4.7,11.1 3.24,11.1
  Bottom Layer w0.5: 41.78,36.89 41.78,39.17 39.75,41.2 v1(39.75,42.98) ; v1(42.04,20.63) 47.62,20.63 v1(47.75,20.5) ; USB1.7 7.11,19.81 7.11,25.84 9.53,28.25 v1(32.64,28.25) ; USB1.7 3.24,42.91 2.67,43.49 H2.1 ; v1(34.04,18.98) 31.62,16.57 31.62,6.41 32.89,5.14 v1(34.93,5.14)
VCC: length 184.2
  Top Layer w0.5: U1.10 31.4,29.87 v1(31.37,29.9) 31.37,38.28 32.38,39.3 43.69,39.3 44.32,38.66 44.32,36.89 ; v1(14.22,11.36) 12.83,9.96 R5.2 ; C1.1 44.2,46.16 43.18,45.14 C2.1 36.18,46.3 34.91,47.57 C3.2 ; C1.1 43.94,48.44 43.94,52.51 42.16,54.28 L1.1 ; C1.1 55.03,48.19 54.99,48.15 BUZZER1.1 ; v1(18.54,11.36) 18.65,11.25 R6.2 R7.2 22.88,12.52 24.26,13.9 30.34,13.9 31.12,13.12 31.12,11.99 31.62,11.49 33.78,11.49 34.27,10.99 R8.2 35.69,9.96 36.7,8.95 36.7,5.14 37.59,4.25 41.66,4.25 41.78,4.37 41.78,10.85 43.05,12.12 U3.8 ; C5.1 C9.1 R13.2 44.96,13.9 44.32,13.26 44.32,12.22 U3.8 ; R3.1 47.26,12.12 U3.8 ; v1(28.07,29.9) 25.27,29.9 13.59,18.22 13.59,16.06 12.57,15.04 KEY.5
  Bottom Layer w0.5: C1.1 42.67,48.19 41.91,47.43 41.91,42.6 44.2,40.31 44.2,37.01 44.32,36.89 ; v1(31.37,29.9) v1(28.07,29.9) ; 11.59,15.42 12.7,15.42 14.22,13.9 v1(14.22,11.36) v1(18.54,11.36)
BZP37: length 14.2
  Top Layer w0.254: R10.2 39.75,22.03 39.1,22.68 39.1,23.63
DHT: length 44.1
  Top Layer w0.254: v1(49.53,14.91) 49.64,14.8 R3.2 49.53,11.63 v1(49.53,9.96) ; v1(44.45,5.39) 44.45,4.12 ; 38.3,32.11 38.23,32.18 v1(38.23,33.58)
  Bottom Layer w0.254: v1(44.45,5.39) 48.64,5.39 49.53,6.28 v1(49.53,9.96) ; v1(49.53,14.91) 49.53,28.76 44.7,33.58 v1(38.23,33.58)
KEY1: length 42.6
  Top Layer w0.254: SW1.2 9.41,8.16 R5.1 9.41,15.66 v1(9.4,15.68) ; v1(32.64,25.96) 35.16,25.96 U1.15
  Bottom Layer w0.254: v1(9.4,15.68) 9.4,23.8 11.56,25.96 v1(32.64,25.96)
KEY2: length 32.1
  Top Layer w0.254: 16.41,8.05 16.65,8.29 R6.1 17.53,10.83 17.53,14.41 17.65,14.53 17.65,19.87 22.85,25.07 U1.16
KEY3: length 25.7
  Top Layer w0.254: v1(28.58,9.96) R7.1 24.88,8.26 SW3.2 ; 36.7,23.63 36.62,23.55 v1(32.77,23.55)
  Bottom Layer w0.254: v1(28.58,9.96) 29.97,11.36 29.97,21.77 31.88,23.68 32,23.55 v1(32.77,23.55)
KEY4: length 21.9
  Top Layer w0.254: SW4.2 32.27,8.29 R8.1 31.37,9.96 v1(30.73,10.6) ; v1(36.83,21.52) 37.5,22.19 37.5,23.63
  Bottom Layer w0.254: v1(36.83,21.52) 33.02,21.52 30.73,19.23 v1(30.73,10.6)
LED: length 28.5
  Top Layer w0.254: LED1.4 22.88,13.92 24,15.04 24,16.95 27.43,20.38 v1(34.16,20.38) ; v1(43.69,23.63) 42.3,23.63
  Bottom Layer w0.254: v1(43.69,23.63) 40.44,20.38 v1(34.16,20.38)
OUTP36: length 25
  Top Layer w0.254: 38.3,23.63 38.3,22.21 39.12,21.39 44.32,21.39 44.96,20.76 R13.1 43.67,18.71 43.43,18.47 43.43,14.41 43.56,14.28 v1(43.56,14.03) ; v1(46.1,9.71) 45.97,9.58 U3.6
  Bottom Layer w0.254: v1(43.56,14.03) 45.09,14.03 46.1,13.01 v1(46.1,9.71)
PWM1N: length 30.6
  Top Layer w0.254: C4.2 v1(31.86,51.63) ; v1(41.53,34.22) 41.53,32.14 U1.2
  Bottom Layer w0.254: v1(31.86,51.63) 31.86,35.88 33.53,34.22 v1(41.53,34.22)
RXD: length 49.5
  Top Layer w0.254: H2.3 11.18,48.57 13.84,45.9 25.53,45.9 30.23,41.2 30.23,28.63 31.39,27.47 U1.13
SCL: length 11.2
  Top Layer w0.254: 46.86,36.89 46.86,35.74 46.35,35.23 40.26,35.23 39.9,34.87 39.9,32.11
SDA: length 13
  Top Layer w0.254: U1.3 40.7,34.66 40.89,34.85 48.64,34.85 49.53,35.74 49.53,36.76 49.4,36.89
TXD: length 48.7
  Top Layer w0.254: H2.2 10.92,46.03 11.81,45.14 24.89,45.14 29.34,40.7 29.34,28.25 30.99,26.6 35.19,26.6 U1.14
$1N10142: length 10.1
  Top Layer w0.254: 33.49,56.86 33.15,57.21 X1.2
$1N10159: length 27.6
  Top Layer w0.254: L1.3 34.16,53.65 33.78,54.03 22.1,54.03 20.96,55.17 20.96,57.21 ; Q1.3 18.54,55.94 19.81,57.21 20.96,57.21 ; 20.96,57.21 21.08,57.08 21.08,56.32
$1N10823: length 6.4
  Top Layer w0.254: R2.1 27.45,51.62 C4.1
$1N13950: length 8.2
  Top Layer w0.254: C6.1 35.94,11.74 36.7,10.98 38.7,10.98 U3.2
$1N13954: length 9.8
  Top Layer w0.254: C7.1 39,16.82 40.26,16.82 40.39,16.69 40.39,10.07 39.9,9.58 U3.3
$1N13974: length 10.8
  Top Layer w0.254: U3.4 38.96,8.44 40.64,8.44 41.15,8.95 41.15,11.49 41.91,12.25 C8.1
$1N14222: length 3.4
  Top Layer w0.254: U3.5 R12.1
$1N14357: length 8.1
  Top Layer w0.254: 50.02,8.69 R12.2 51.94,8.31 53.09,9.45 56.39,9.45 水位监测.1
$1N14582: length 3.8
  Top Layer w0.254: R10.1 54.11,22.05 Q2.1
$1N14588: length 19.4
  Top Layer w0.254: Q2.3 51.94,26.86 v1(51.94,29.65)
  Bottom Layer w0.254: BUZZER1.2 54.61,38.66 55.25,38.03 55.25,30.79 54.1,29.65 v1(51.94,29.65)
$1N14898: length 41.3
  Top Layer w0.254: v1(22.86,23.42) 21.88,22.45 21.88,17.05 LED1.3 ; R11.2 50.29,32.19 49.02,30.92 49.02,27.74 v1(45.97,24.69)
  Bottom Layer w0.254: v1(22.86,23.42) 24.13,24.69 v1(45.97,24.69)
$1N21387: length 8.7
  Top Layer w0.254: 19.07,51.49 18.94,51.62 R1.1 15.11,51.98 15.11,54.67 14.79,54.99 Q1.1

## Text on the board
Top Silkscreen Layer: #加湿器#
